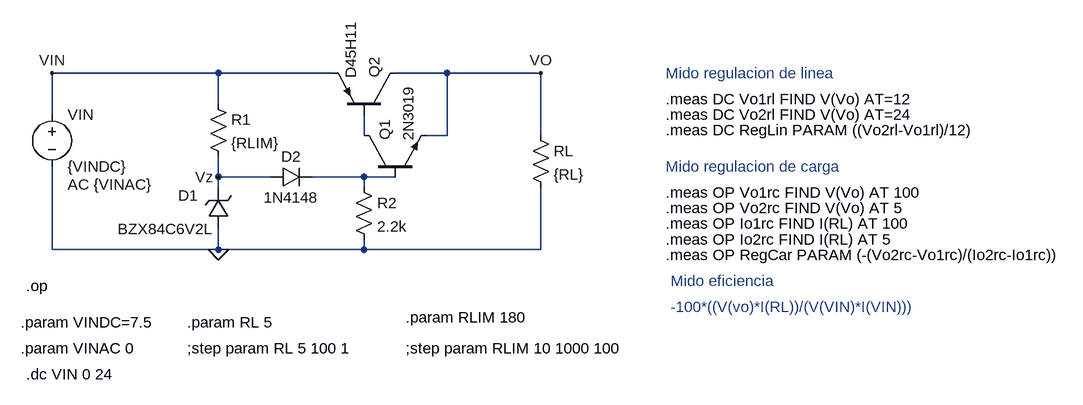
[diagram p0: schematic Regulador_lineal_version2.asc]
Regulador_lineal_version2.asc, the LTspice schematic file:
Version 4
SHEET 1 1428 680
WIRE 80 64 -176 64
WIRE 256 64 80 64
WIRE 432 64 352 64
WIRE 576 64 432 64
WIRE 80 112 80 64
WIRE -176 128 -176 64
WIRE 304 160 304 128
WIRE 432 160 432 64
WIRE 432 160 400 160
WIRE 576 160 576 64
WIRE 80 224 80 192
WIRE 160 224 80 224
WIRE 304 224 224 224
WIRE 352 224 304 224
WIRE 80 240 80 224
WIRE 304 240 304 224
WIRE -176 336 -176 208
WIRE 80 336 80 304
WIRE 80 336 -176 336
WIRE 304 336 304 320
WIRE 304 336 80 336
WIRE 576 336 576 240
WIRE 576 336 304 336
FLAG 80 336 0
FLAG -176 64 VIN
FLAG 576 64 VO
FLAG 80 224 Vz
DATAFLAG 448 64 ""
SYMBOL res 64 96 R0
SYMATTR InstName R1
SYMATTR Value {RLIM}
SYMBOL zener 96 304 R180
WINDOW 0 47 51 Left 2
WINDOW 3 24 0 Left 2
SYMATTR InstName D1
SYMATTR Value BZX84C6V2L
SYMBOL voltage -176 112 R0
WINDOW 123 24 124 Left 2
WINDOW 39 0 0 Left 0
SYMATTR Value2 AC {VINAC}
SYMATTR InstName VIN
SYMATTR Value {VINDC}
SYMBOL res 560 144 R0
SYMATTR InstName RL
SYMATTR Value {RL}
SYMBOL npn 304 224 R270
SYMATTR InstName Q1
SYMATTR Value 2N3019
SYMBOL diode 160 240 R270
WINDOW 0 32 32 VTop 2
WINDOW 3 0 32 VBottom 2
SYMATTR InstName D2
SYMATTR Value 1N4148
SYMBOL res 288 224 R0
SYMATTR InstName R2
SYMATTR Value 2.2k
SYMBOL pnp 352 128 M270
SYMATTR InstName Q2
SYMATTR Value D45H11
TEXT -216 392 Left 2 !.op
TEXT -216 528 Left 2 !.dc VIN 0 24
TEXT -224 448 Left 2 !.param VINDC=7.5
TEXT -224 488 Left 2 !.param VINAC 0
TEXT 32 488 Left 2 !;step param RL 5 100 1
TEXT 32 448 Left 2 !.param RL 5
TEXT 368 488 Left 2 !;step param RLIM 10 1000 100
TEXT 368 440 Left 2 !.param RLIM 180
TEXT 768 64 Left 2 ;Mido regulacion de linea
TEXT 768 104 Left 2 !.meas DC Vo1rl FIND V(Vo) AT=12
TEXT 768 128 Left 2 !.meas DC Vo2rl FIND V(Vo) AT=24
TEXT 768 152 Left 2 !.meas DC RegLin PARAM ((Vo2rl-Vo1rl)/12)
TEXT 768 208 Left 2 ;Mido regulacion de carga
TEXT 768 248 Left 2 !.meas OP Vo1rc FIND V(Vo) AT 100
TEXT 768 272 Left 2 !.meas OP Vo2rc FIND V(Vo) AT 5
TEXT 768 344 Left 2 !.meas OP RegCar PARAM (-(Vo2rc-Vo1rc)/(Io2rc-Io1rc))
TEXT 768 296 Left 2 !.meas OP Io1rc FIND I(RL) AT 100
TEXT 768 320 Left 2 !.meas OP Io2rc FIND I(RL) AT 5
TEXT 776 384 Left 2 ;Mido eficiencia
TEXT 776 424 Left 2 ;-100*((V(vo)*I(RL))/(V(VIN)*I(VIN)))

The netlist it stands for:
* Regulador_lineal_version2.asc
R1 VIN Vz {RLIM}
D1 0 Vz BZX84C6V2L
VIN VIN 0 {VINDC} AC {VINAC}
RL VO 0 {RL}
Q1 N001 N002 VO 0 2N3019
D2 Vz N002 1N4148
R2 N002 0 2.2k
Q2 VO N001 VIN 0 D45H11
.model D D
.lib standard.dio
.model NPN NPN
.model PNP PNP
.lib standard.bjt
.op
.dc VIN 0 24
.param VINDC=7.5
.param VINAC 0
;step param RL 5 100 1
.param RL 5
;step param RLIM 10 1000 100
.param RLIM 180
* Mido regulacion de linea
.meas DC Vo1rl FIND V(Vo) AT=12
.meas DC Vo2rl FIND V(Vo) AT=24
.meas DC RegLin PARAM ((Vo2rl-Vo1rl)/12)
* Mido regulacion de carga
.meas OP Vo1rc FIND V(Vo) AT 100
.meas OP Vo2rc FIND V(Vo) AT 5
.meas OP RegCar PARAM (-(Vo2rc-Vo1rc)/(Io2rc-Io1rc))
.meas OP Io1rc FIND I(RL) AT 100
.meas OP Io2rc FIND I(RL) AT 5
* Mido eficiencia
* -100*((V(vo)*I(RL))/(V(VIN)*I(VIN)))
.backanno
.end